# EAGLE schematic dbg-ram-4x8K (EAGLE 9.1.3)
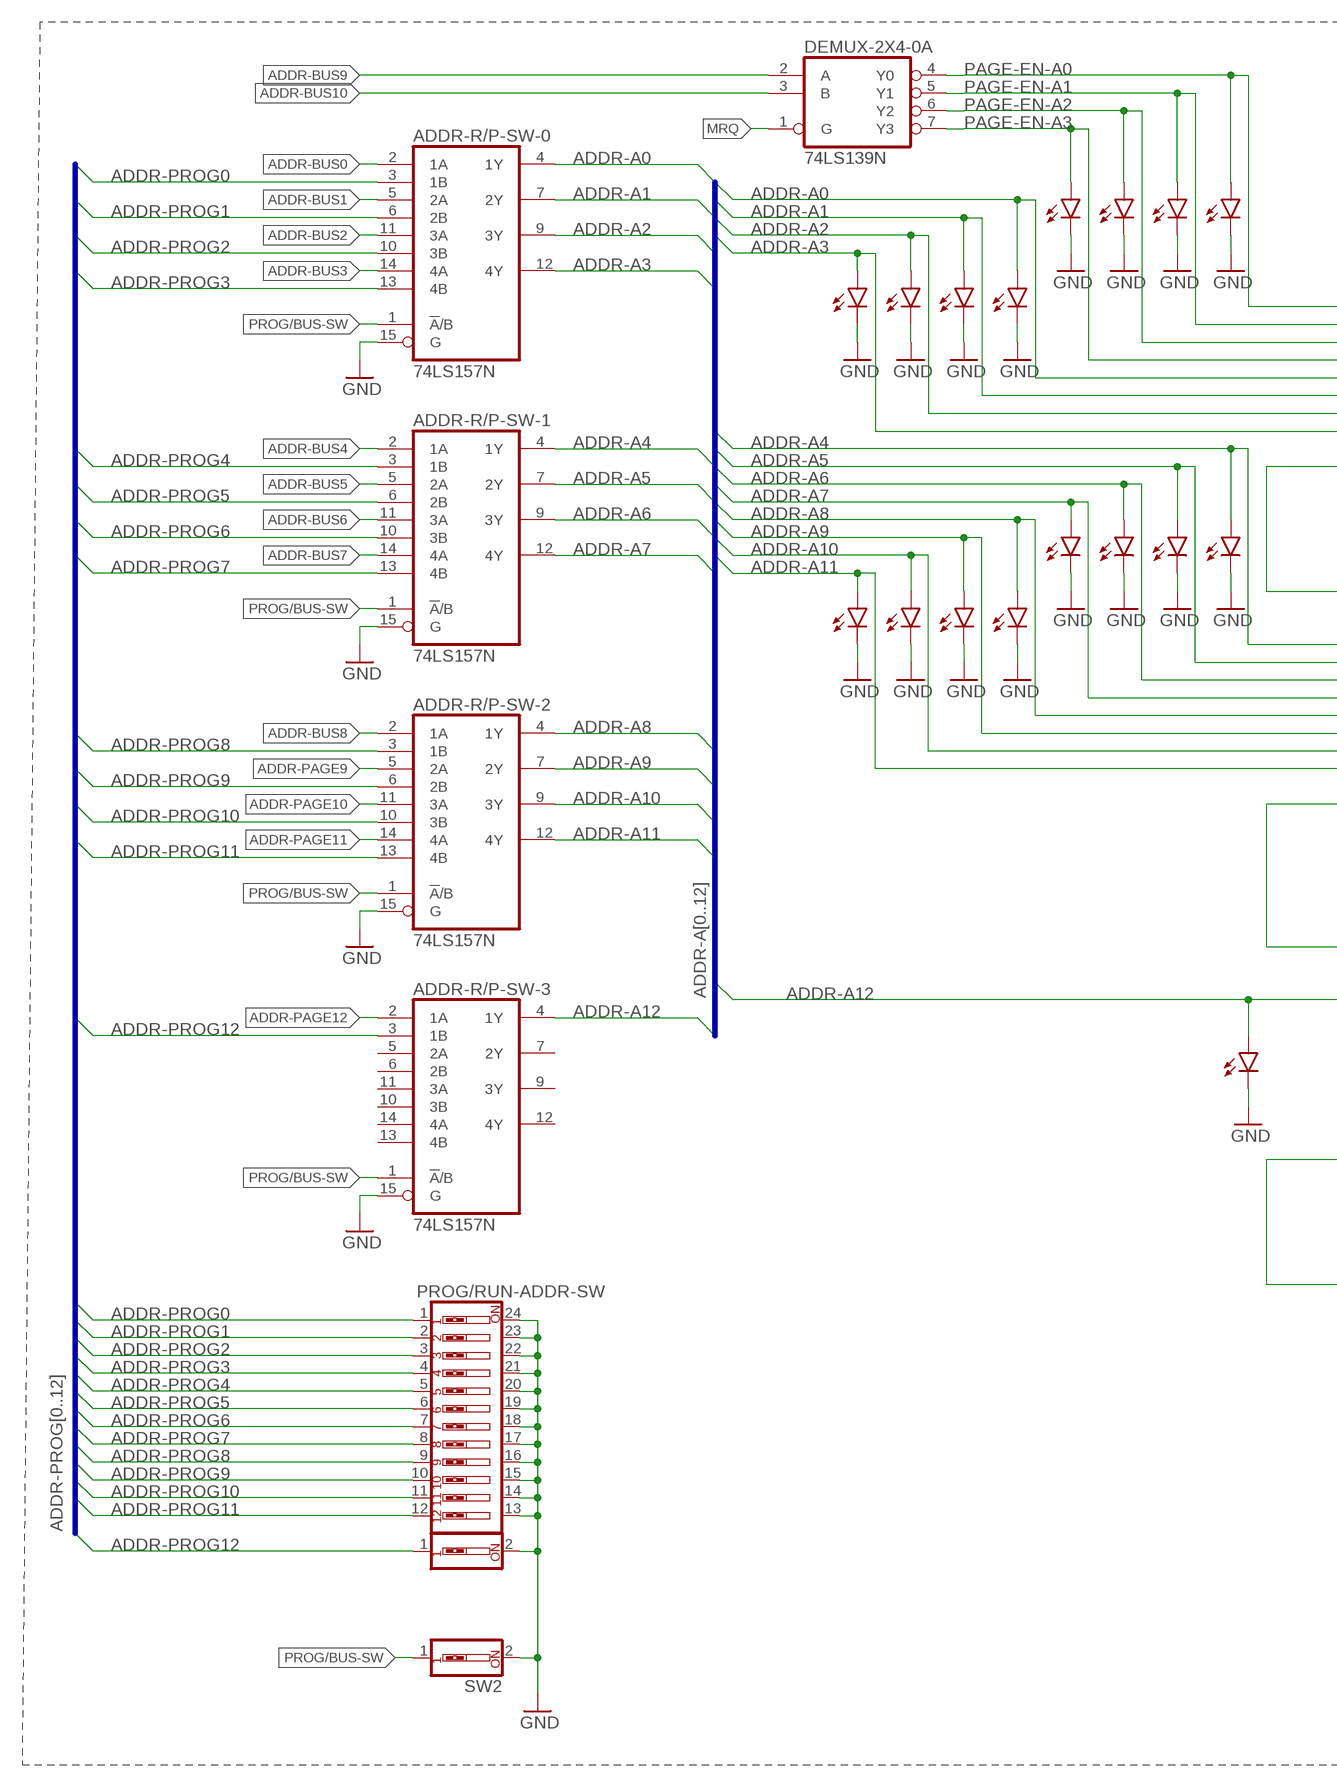
[diagram p0: schematic, sheet 1, part 1 of 2]
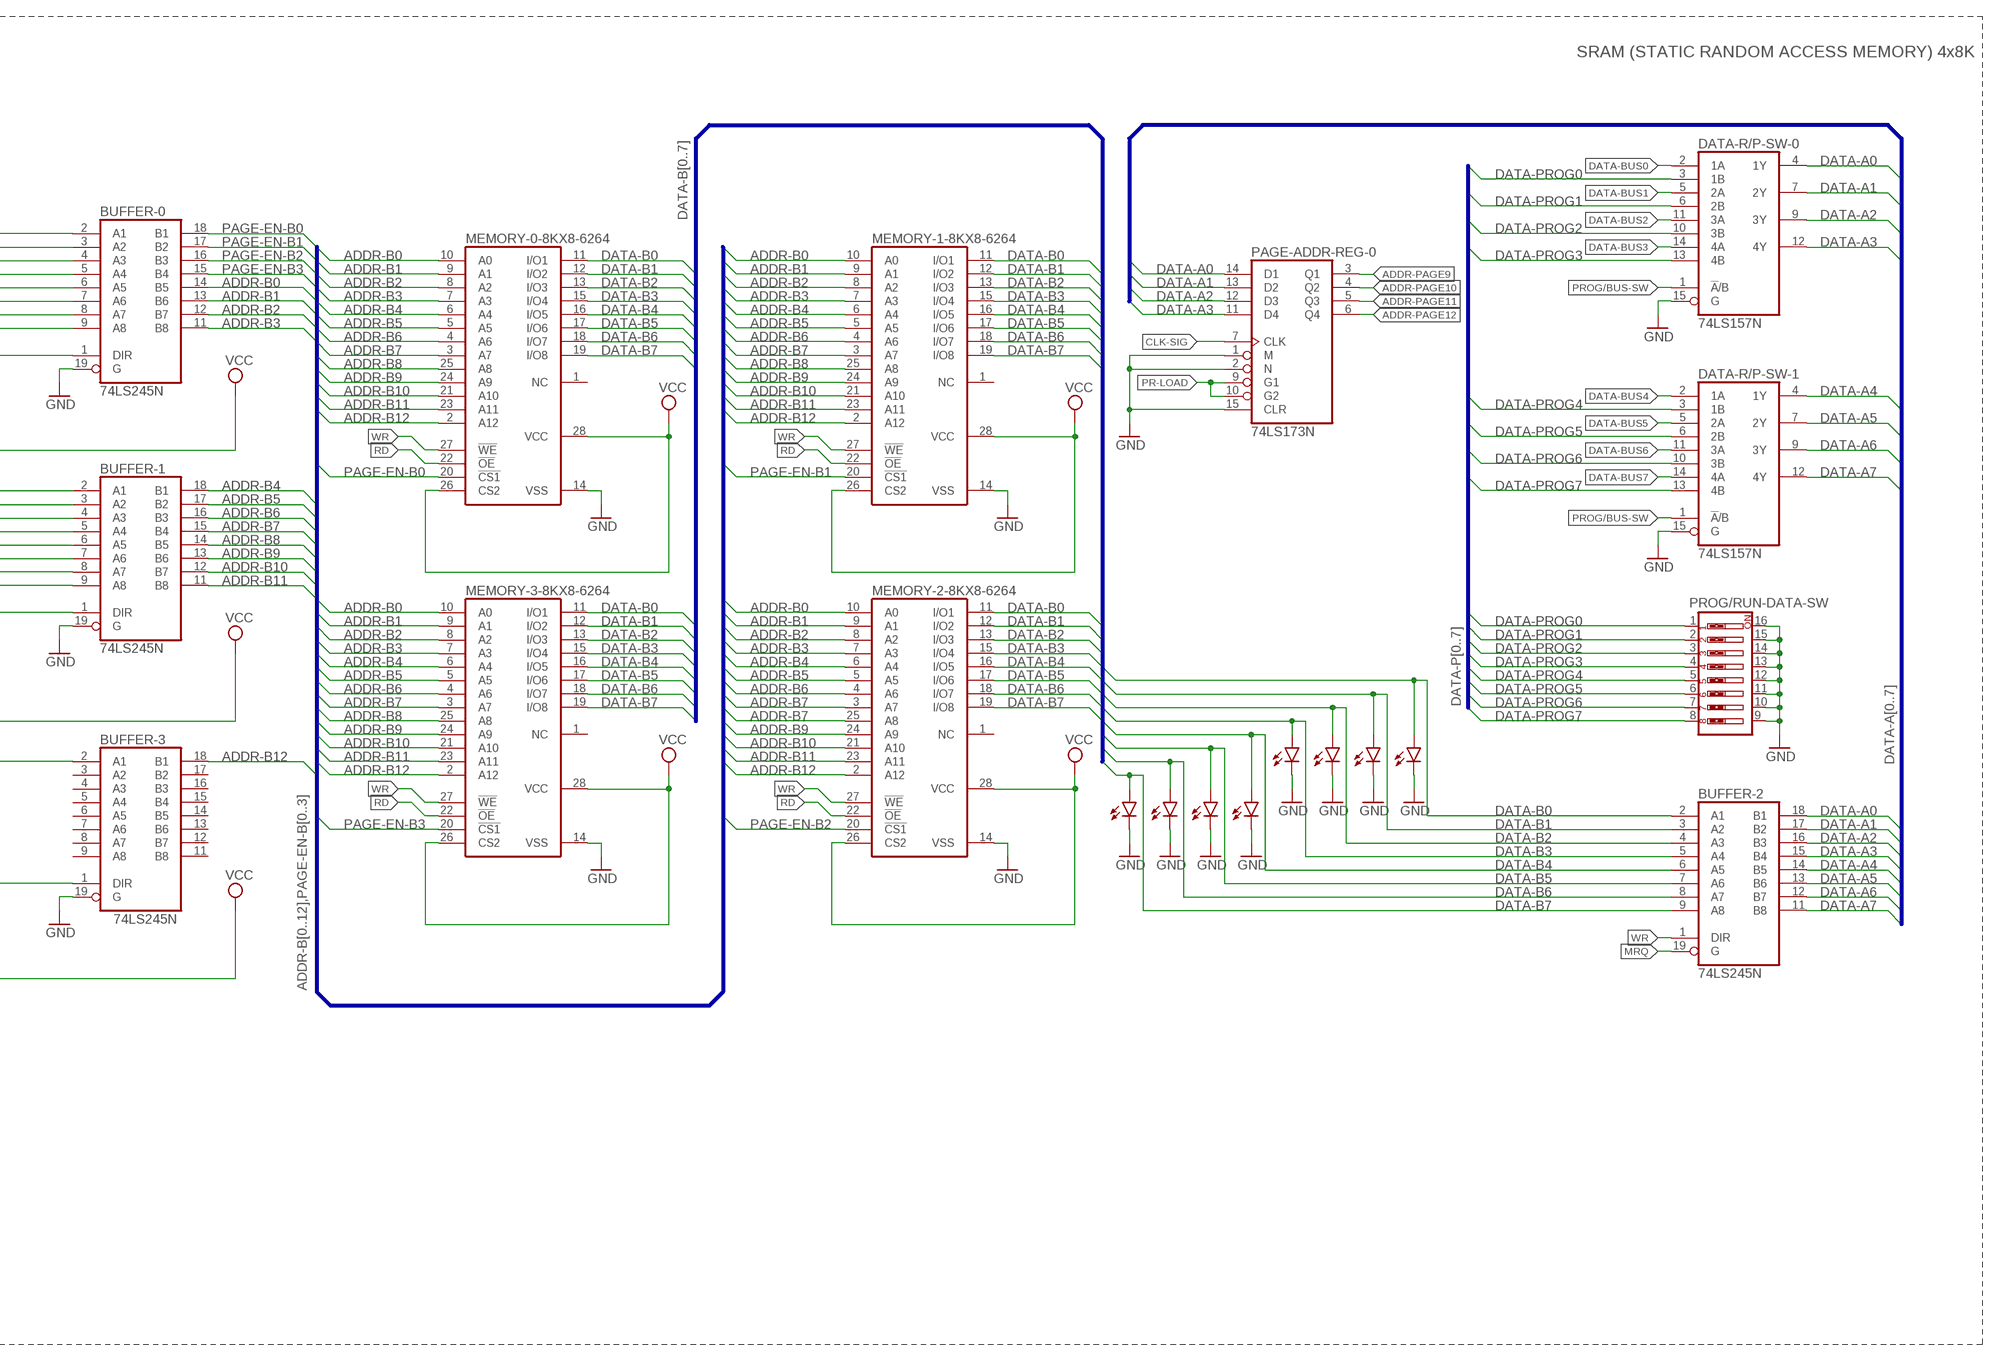
[diagram p1: schematic, sheet 1, part 2 of 2]

## Parts
ADDR-R/P-SW-0  74LS157N  [DIL16]
ADDR-R/P-SW-1  74LS157N  [DIL16]
ADDR-R/P-SW-2  74LS157N  [DIL16]
ADDR-R/P-SW-3  74LS157N  [DIL16]
BUFFER-0  74LS245N  [DIL20]
BUFFER-1  74LS245N  [DIL20]
BUFFER-2  74LS245N  [DIL20]
BUFFER-3  74LS245N  [DIL20]
DATA-R/P-SW-0  74LS157N  [DIL16]
DATA-R/P-SW-1  74LS157N  [DIL16]
DEMUX-2X4-0  74LS139N  [DIL16]
LED1  LED5MM  [LED5MM]
LED2  LED5MM  [LED5MM]
LED3  LED5MM  [LED5MM]
LED4  LED5MM  [LED5MM]
LED5  LED5MM  [LED5MM]
LED6  LED5MM  [LED5MM]
LED7  LED5MM  [LED5MM]
LED8  LED5MM  [LED5MM]
LED9  LED5MM  [LED5MM]
LED10  LED5MM  [LED5MM]
LED11  LED5MM  [LED5MM]
LED12  LED5MM  [LED5MM]
LED13  LED5MM  [LED5MM]
LED14  LED5MM  [LED5MM]
LED15  LED5MM  [LED5MM]
LED16  LED5MM  [LED5MM]
LED17  LED5MM  [LED5MM]
LED18  LED5MM  [LED5MM]
LED19  LED5MM  [LED5MM]
LED20  LED5MM  [LED5MM]
LED21  LED5MM  [LED5MM]
LED22  LED5MM  [LED5MM]
LED23  LED5MM  [LED5MM]
LED24  LED5MM  [LED5MM]
LED25  LED5MM  [LED5MM]
MEMORY-0-8KX8-6264  6264A  [DIL28-6]
MEMORY-1-8KX8-6264  6264A  [DIL28-6]
MEMORY-2-8KX8-6264  6264A  [DIL28-6]
MEMORY-3-8KX8-6264  6264A  [DIL28-6]
PAGE-ADDR-REG-0  74LS173N  [DIL16]
PROG/RUN-ADDR-SW  SW_DIP-12  [EDG-12]
PROG/RUN-DATA-SW  SW_DIP-8  [EDG-08]
SW2  SW_DIP-1  [EDG-01]
SW3  SW_DIP-1  [EDG-01]

## Nets
ADDR-A0: ADDR-R/P-SW-0.4(1Y) BUFFER-0.6(A5) LED1.A
ADDR-A1: ADDR-R/P-SW-0.7(2Y) BUFFER-0.7(A6) LED2.A
ADDR-A2: ADDR-R/P-SW-0.9(3Y) BUFFER-0.8(A7) LED3.A
ADDR-A3: ADDR-R/P-SW-0.12(4Y) BUFFER-0.9(A8) LED4.A
ADDR-A4: ADDR-R/P-SW-1.4(1Y) BUFFER-1.2(A1) LED5.A
ADDR-A5: ADDR-R/P-SW-1.7(2Y) BUFFER-1.3(A2) LED6.A
ADDR-A6: ADDR-R/P-SW-1.9(3Y) BUFFER-1.4(A3) LED10.A
ADDR-A7: ADDR-R/P-SW-1.12(4Y) BUFFER-1.5(A4) LED7.A
ADDR-A8: ADDR-R/P-SW-2.4(1Y) BUFFER-1.6(A5) LED8.A
ADDR-A9: ADDR-R/P-SW-2.7(2Y) BUFFER-1.7(A6) LED9.A
ADDR-A10: ADDR-R/P-SW-2.9(3Y) BUFFER-1.8(A7) LED15.A
ADDR-A11: ADDR-R/P-SW-2.12(4Y) BUFFER-1.9(A8) LED17.A
ADDR-A12: ADDR-R/P-SW-3.4(1Y) BUFFER-3.2(A1) LED16.A
ADDR-B0: BUFFER-0.14(B5) MEMORY-0-8KX8-6264.10(A0) MEMORY-1-8KX8-6264.10(A0) MEMORY-2-8KX8-6264.10(A0) MEMORY-3-8KX8-6264.10(A0)
ADDR-B1: BUFFER-0.13(B6) MEMORY-0-8KX8-6264.9(A1) MEMORY-1-8KX8-6264.9(A1) MEMORY-2-8KX8-6264.9(A1) MEMORY-3-8KX8-6264.9(A1)
ADDR-B2: BUFFER-0.12(B7) MEMORY-0-8KX8-6264.8(A2) MEMORY-1-8KX8-6264.8(A2) MEMORY-2-8KX8-6264.8(A2) MEMORY-3-8KX8-6264.8(A2)
ADDR-B3: BUFFER-0.11(B8) MEMORY-0-8KX8-6264.7(A3) MEMORY-1-8KX8-6264.7(A3) MEMORY-2-8KX8-6264.7(A3) MEMORY-3-8KX8-6264.7(A3)
ADDR-B4: BUFFER-1.18(B1) MEMORY-0-8KX8-6264.6(A4) MEMORY-1-8KX8-6264.6(A4) MEMORY-2-8KX8-6264.6(A4) MEMORY-3-8KX8-6264.6(A4)
ADDR-B5: BUFFER-1.17(B2) MEMORY-0-8KX8-6264.5(A5) MEMORY-1-8KX8-6264.5(A5) MEMORY-2-8KX8-6264.5(A5) MEMORY-3-8KX8-6264.5(A5)
ADDR-B6: BUFFER-1.16(B3) MEMORY-0-8KX8-6264.4(A6) MEMORY-1-8KX8-6264.4(A6) MEMORY-2-8KX8-6264.4(A6) MEMORY-3-8KX8-6264.4(A6)
ADDR-B7: BUFFER-1.15(B4) MEMORY-0-8KX8-6264.3(A7) MEMORY-1-8KX8-6264.3(A7) MEMORY-2-8KX8-6264.3(A7) MEMORY-2-8KX8-6264.25(A8) MEMORY-3-8KX8-6264.3(A7)
ADDR-B8: BUFFER-1.14(B5) MEMORY-0-8KX8-6264.25(A8) MEMORY-1-8KX8-6264.25(A8) MEMORY-3-8KX8-6264.25(A8)
ADDR-B9: BUFFER-1.13(B6) MEMORY-0-8KX8-6264.24(A9) MEMORY-1-8KX8-6264.24(A9) MEMORY-2-8KX8-6264.24(A9) MEMORY-3-8KX8-6264.24(A9)
ADDR-B10: BUFFER-1.12(B7) MEMORY-0-8KX8-6264.21(A10) MEMORY-1-8KX8-6264.21(A10) MEMORY-2-8KX8-6264.21(A10) MEMORY-3-8KX8-6264.21(A10)
ADDR-B11: BUFFER-1.11(B8) MEMORY-0-8KX8-6264.23(A11) MEMORY-1-8KX8-6264.23(A11) MEMORY-2-8KX8-6264.23(A11) MEMORY-3-8KX8-6264.23(A11)
ADDR-B12: BUFFER-3.18(B1) MEMORY-0-8KX8-6264.2(A12) MEMORY-1-8KX8-6264.2(A12) MEMORY-2-8KX8-6264.2(A12) MEMORY-3-8KX8-6264.2(A12)
ADDR-BUS0: ADDR-R/P-SW-0.2(1A)
ADDR-BUS1: ADDR-R/P-SW-0.5(2A)
ADDR-BUS2: ADDR-R/P-SW-0.11(3A)
ADDR-BUS3: ADDR-R/P-SW-0.14(4A)
ADDR-BUS4: ADDR-R/P-SW-1.2(1A)
ADDR-BUS5: ADDR-R/P-SW-1.5(2A)
ADDR-BUS6: ADDR-R/P-SW-1.11(3A)
ADDR-BUS7: ADDR-R/P-SW-1.14(4A)
ADDR-BUS8: ADDR-R/P-SW-2.2(1A)
ADDR-BUS9: DEMUX-2X4-0.2(A:A)
ADDR-BUS10: DEMUX-2X4-0.3(A:B)
ADDR-PAGE9: ADDR-R/P-SW-2.5(2A) PAGE-ADDR-REG-0.3(Q1)
ADDR-PAGE10: ADDR-R/P-SW-2.11(3A) PAGE-ADDR-REG-0.4(Q2)
ADDR-PAGE11: ADDR-R/P-SW-2.14(4A) PAGE-ADDR-REG-0.5(Q3)
ADDR-PAGE12: ADDR-R/P-SW-3.2(1A) PAGE-ADDR-REG-0.6(Q4)
ADDR-PROG0: ADDR-R/P-SW-0.3(1B) PROG/RUN-ADDR-SW.1
ADDR-PROG1: ADDR-R/P-SW-0.6(2B) PROG/RUN-ADDR-SW.2
ADDR-PROG2: ADDR-R/P-SW-0.10(3B) PROG/RUN-ADDR-SW.3
ADDR-PROG3: ADDR-R/P-SW-0.13(4B) PROG/RUN-ADDR-SW.4
ADDR-PROG4: ADDR-R/P-SW-1.3(1B) PROG/RUN-ADDR-SW.5
ADDR-PROG5: ADDR-R/P-SW-1.6(2B) PROG/RUN-ADDR-SW.6
ADDR-PROG6: ADDR-R/P-SW-1.10(3B) PROG/RUN-ADDR-SW.7
ADDR-PROG7: ADDR-R/P-SW-1.13(4B) PROG/RUN-ADDR-SW.8
ADDR-PROG8: ADDR-R/P-SW-2.3(1B) PROG/RUN-ADDR-SW.9
ADDR-PROG9: ADDR-R/P-SW-2.6(2B) PROG/RUN-ADDR-SW.10
ADDR-PROG10: ADDR-R/P-SW-2.10(3B) PROG/RUN-ADDR-SW.11
ADDR-PROG11: ADDR-R/P-SW-2.13(4B) PROG/RUN-ADDR-SW.12
ADDR-PROG12: ADDR-R/P-SW-3.3(1B) SW3.1
CLK-SIG: PAGE-ADDR-REG-0.7(CLK)
DATA-A0: BUFFER-2.18(B1) DATA-R/P-SW-0.4(1Y) PAGE-ADDR-REG-0.14(D1)
DATA-A1: BUFFER-2.17(B2) DATA-R/P-SW-0.7(2Y) PAGE-ADDR-REG-0.13(D2)
DATA-A2: BUFFER-2.16(B3) DATA-R/P-SW-0.9(3Y) PAGE-ADDR-REG-0.12(D3)
DATA-A3: BUFFER-2.15(B4) DATA-R/P-SW-0.12(4Y) PAGE-ADDR-REG-0.11(D4)
DATA-A4: BUFFER-2.14(B5) DATA-R/P-SW-1.4(1Y)
DATA-A5: BUFFER-2.13(B6) DATA-R/P-SW-1.7(2Y)
DATA-A6: BUFFER-2.12(B7) DATA-R/P-SW-1.9(3Y)
DATA-A7: BUFFER-2.11(B8) DATA-R/P-SW-1.12(4Y)
DATA-B0: BUFFER-2.2(A1) LED25.A MEMORY-0-8KX8-6264.11(I/O1) MEMORY-1-8KX8-6264.11(I/O1) MEMORY-2-8KX8-6264.11(I/O1) MEMORY-3-8KX8-6264.11(I/O1)
DATA-B1: BUFFER-2.3(A2) LED24.A MEMORY-0-8KX8-6264.12(I/O2) MEMORY-1-8KX8-6264.12(I/O2) MEMORY-2-8KX8-6264.12(I/O2) MEMORY-3-8KX8-6264.12(I/O2)
DATA-B2: BUFFER-2.4(A3) LED23.A MEMORY-0-8KX8-6264.13(I/O3) MEMORY-1-8KX8-6264.13(I/O3) MEMORY-2-8KX8-6264.13(I/O3) MEMORY-3-8KX8-6264.13(I/O3)
DATA-B3: BUFFER-2.5(A4) LED22.A MEMORY-0-8KX8-6264.15(I/O4) MEMORY-1-8KX8-6264.15(I/O4) MEMORY-2-8KX8-6264.15(I/O4) MEMORY-3-8KX8-6264.15(I/O4)
DATA-B4: BUFFER-2.6(A5) LED21.A MEMORY-0-8KX8-6264.16(I/O5) MEMORY-1-8KX8-6264.16(I/O5) MEMORY-2-8KX8-6264.16(I/O5) MEMORY-3-8KX8-6264.16(I/O5)
DATA-B5: BUFFER-2.7(A6) LED20.A MEMORY-0-8KX8-6264.17(I/O6) MEMORY-1-8KX8-6264.17(I/O6) MEMORY-2-8KX8-6264.17(I/O6) MEMORY-3-8KX8-6264.17(I/O6)
DATA-B6: BUFFER-2.8(A7) LED19.A MEMORY-0-8KX8-6264.18(I/O7) MEMORY-1-8KX8-6264.18(I/O7) MEMORY-2-8KX8-6264.18(I/O7) MEMORY-3-8KX8-6264.18(I/O7)
DATA-B7: BUFFER-2.9(A8) LED18.A MEMORY-0-8KX8-6264.19(I/O8) MEMORY-1-8KX8-6264.19(I/O8) MEMORY-2-8KX8-6264.19(I/O8) MEMORY-3-8KX8-6264.19(I/O8)
DATA-BUS0: DATA-R/P-SW-0.2(1A)
DATA-BUS1: DATA-R/P-SW-0.5(2A)
DATA-BUS2: DATA-R/P-SW-0.11(3A)
DATA-BUS3: DATA-R/P-SW-0.14(4A)
DATA-BUS4: DATA-R/P-SW-1.2(1A)
DATA-BUS5: DATA-R/P-SW-1.5(2A)
DATA-BUS6: DATA-R/P-SW-1.11(3A)
DATA-BUS7: DATA-R/P-SW-1.14(4A)
DATA-PROG0: DATA-R/P-SW-0.3(1B) PROG/RUN-DATA-SW.1
DATA-PROG1: DATA-R/P-SW-0.6(2B) PROG/RUN-DATA-SW.2
DATA-PROG2: DATA-R/P-SW-0.10(3B) PROG/RUN-DATA-SW.3
DATA-PROG3: DATA-R/P-SW-0.13(4B) PROG/RUN-DATA-SW.4
DATA-PROG4: DATA-R/P-SW-1.3(1B) PROG/RUN-DATA-SW.5
DATA-PROG5: DATA-R/P-SW-1.6(2B) PROG/RUN-DATA-SW.6
DATA-PROG6: DATA-R/P-SW-1.10(3B) PROG/RUN-DATA-SW.7
DATA-PROG7: DATA-R/P-SW-1.13(4B) PROG/RUN-DATA-SW.8
GND: ADDR-R/P-SW-0.15(G) ADDR-R/P-SW-1.15(G) ADDR-R/P-SW-2.15(G) ADDR-R/P-SW-3.15(G) BUFFER-0.19(G) BUFFER-1.19(G) BUFFER-3.19(G) DATA-R/P-SW-0.15(G) DATA-R/P-SW-1.15(G) LED1.K(C) LED2.K(C) LED3.K(C) LED4.K(C) LED5.K(C) LED6.K(C) LED7.K(C) LED8.K(C) LED9.K(C) LED10.K(C) LED11.K(C) LED12.K(C) LED13.K(C) LED14.K(C) LED15.K(C) LED16.K(C) LED17.K(C) LED18.K(C) LED19.K(C) LED20.K(C) LED21.K(C) LED22.K(C) LED23.K(C) LED24.K(C) LED25.K(C) MEMORY-0-8KX8-6264.14(VSS) MEMORY-1-8KX8-6264.14(VSS) MEMORY-2-8KX8-6264.14(VSS) MEMORY-3-8KX8-6264.14(VSS) PAGE-ADDR-REG-0.1(M) PAGE-ADDR-REG-0.2(N) PAGE-ADDR-REG-0.15(CLR) PROG/RUN-ADDR-SW.13 PROG/RUN-ADDR-SW.14 PROG/RUN-ADDR-SW.15 PROG/RUN-ADDR-SW.16 PROG/RUN-ADDR-SW.17 PROG/RUN-ADDR-SW.18 PROG/RUN-ADDR-SW.19 PROG/RUN-ADDR-SW.20 PROG/RUN-ADDR-SW.21 PROG/RUN-ADDR-SW.22 PROG/RUN-ADDR-SW.23 PROG/RUN-ADDR-SW.24 PROG/RUN-DATA-SW.9 PROG/RUN-DATA-SW.10 PROG/RUN-DATA-SW.11 PROG/RUN-DATA-SW.12 PROG/RUN-DATA-SW.13 PROG/RUN-DATA-SW.14 PROG/RUN-DATA-SW.15 PROG/RUN-DATA-SW.16 SW2.2 SW3.2
MRQ: BUFFER-2.19(G) DEMUX-2X4-0.1(A:G)
PAGE-EN-A0: BUFFER-0.2(A1) DEMUX-2X4-0.4(A:Y0) LED11.A
PAGE-EN-A1: BUFFER-0.3(A2) DEMUX-2X4-0.5(A:Y1) LED12.A
PAGE-EN-A2: BUFFER-0.4(A3) DEMUX-2X4-0.6(A:Y2) LED13.A
PAGE-EN-A3: BUFFER-0.5(A4) DEMUX-2X4-0.7(A:Y3) LED14.A
PAGE-EN-B0: BUFFER-0.18(B1) MEMORY-0-8KX8-6264.20(!CS1)
PAGE-EN-B1: BUFFER-0.17(B2) MEMORY-1-8KX8-6264.20(!CS1)
PAGE-EN-B2: BUFFER-0.16(B3) MEMORY-2-8KX8-6264.20(!CS1)
PAGE-EN-B3: BUFFER-0.15(B4) MEMORY-3-8KX8-6264.20(!CS1)
PR-LOAD: PAGE-ADDR-REG-0.9(G1) PAGE-ADDR-REG-0.10(G2)
PROG/BUS-SW: ADDR-R/P-SW-0.1(!A!/B) ADDR-R/P-SW-1.1(!A!/B) ADDR-R/P-SW-2.1(!A!/B) ADDR-R/P-SW-3.1(!A!/B) DATA-R/P-SW-0.1(!A!/B) DATA-R/P-SW-1.1(!A!/B) SW2.1
RD: MEMORY-0-8KX8-6264.22(!OE) MEMORY-1-8KX8-6264.22(!OE) MEMORY-2-8KX8-6264.22(!OE) MEMORY-3-8KX8-6264.22(!OE)
VCC: BUFFER-0.1(DIR) BUFFER-1.1(DIR) BUFFER-3.1(DIR) MEMORY-0-8KX8-6264.26(CS2) MEMORY-0-8KX8-6264.28(VCC) MEMORY-1-8KX8-6264.26(CS2) MEMORY-1-8KX8-6264.28(VCC) MEMORY-2-8KX8-6264.26(CS2) MEMORY-2-8KX8-6264.28(VCC) MEMORY-3-8KX8-6264.26(CS2) MEMORY-3-8KX8-6264.28(VCC)
WR: BUFFER-2.1(DIR) MEMORY-0-8KX8-6264.27(!WE) MEMORY-1-8KX8-6264.27(!WE) MEMORY-2-8KX8-6264.27(!WE) MEMORY-3-8KX8-6264.27(!WE)
Unconnected: ADDR-R/P-SW-3.5(2A) ADDR-R/P-SW-3.6(2B) ADDR-R/P-SW-3.7(2Y) ADDR-R/P-SW-3.9(3Y) ADDR-R/P-SW-3.10(3B) ADDR-R/P-SW-3.11(3A) ADDR-R/P-SW-3.12(4Y) ADDR-R/P-SW-3.13(4B) ADDR-R/P-SW-3.14(4A) BUFFER-3.3(A2) BUFFER-3.4(A3) BUFFER-3.5(A4) BUFFER-3.6(A5) BUFFER-3.7(A6) BUFFER-3.8(A7) BUFFER-3.9(A8) BUFFER-3.11(B8) BUFFER-3.12(B7) BUFFER-3.13(B6) BUFFER-3.14(B5) BUFFER-3.15(B4) BUFFER-3.16(B3) BUFFER-3.17(B2) DEMUX-2X4-0.9(B:Y3) DEMUX-2X4-0.10(B:Y2) DEMUX-2X4-0.11(B:Y1) DEMUX-2X4-0.12(B:Y0) DEMUX-2X4-0.13(B:B) DEMUX-2X4-0.14(B:A) DEMUX-2X4-0.15(B:G) MEMORY-0-8KX8-6264.1(NC) MEMORY-1-8KX8-6264.1(NC) MEMORY-2-8KX8-6264.1(NC) MEMORY-3-8KX8-6264.1(NC)

## Buses
ADDR-B[0..12],PAGE-EN-B[0..3]
DATA-B[0..7]
ADDR-A[0..12]
ADDR-PROG[0..12]
DATA-A[0..7]
DATA-P[0..7]

## Notes on the sheet
- SRAM (STATIC RANDOM ACCESS MEMORY) 4x8K

## Power pins joined to a net without a drawn wire
GND: ADDR-R/P-SW-0.8(GND) ADDR-R/P-SW-1.8(GND) ADDR-R/P-SW-2.8(GND) ADDR-R/P-SW-3.8(GND) BUFFER-0.10(GND) BUFFER-1.10(GND) BUFFER-2.10(GND) BUFFER-3.10(GND) DATA-R/P-SW-0.8(GND) DATA-R/P-SW-1.8(GND) DEMUX-2X4-0.8(P:GND) PAGE-ADDR-REG-0.8(GND)
VCC: ADDR-R/P-SW-0.16(VCC) ADDR-R/P-SW-1.16(VCC) ADDR-R/P-SW-2.16(VCC) ADDR-R/P-SW-3.16(VCC) BUFFER-0.20(VCC) BUFFER-1.20(VCC) BUFFER-2.20(VCC) BUFFER-3.20(VCC) DATA-R/P-SW-0.16(VCC) DATA-R/P-SW-1.16(VCC) DEMUX-2X4-0.16(P:VCC) PAGE-ADDR-REG-0.16(VCC)

## Library data of the parts
ADDR-R/P-SW-0 ADDR-R/P-SW-1-ADDR-R/P-SW-3 DATA-R/P-SW-0 DATA-R/P-SW-1 = 74xx-eu:74*157: Quadruple 2-line to 1-line data SELECTOR/MULTIPLEXER
BUFFER-0 BUFFER-1-BUFFER-3 = 74xx-eu:74*245: Octal BUS TRANSCEIVER, 3-state
DEMUX-2X4-0 = 74xx-eu:74*139: Dual 2-line to 4-line DECODER/DEMULTIPLEXER
LED1-LED25 = led:LED: LED OSRAM: - CHIPLED LG R971, LG N971, LY N971, LG Q971, LY Q971, LO R971, LY R971 LH N974, LH R974 LS Q976, LO Q976, LY Q976 LO Q996 - Hyper CHIPLED LW Q18S LB Q993, LB Q99A, LB R99A - SideLED LS A670, LO A670, LY A670, LG A670, LP A670 LB A673, LV A673, LT A673, LW A673 LH A674 LY A675 LS A676, LA A676, LO A676, LY A676, LW A676 LS A679, LY A679, LG A679 - Hyper Micro SIDELED® LS Y876, LA Y876, LO Y876, LY Y876 LT Y87S - SmartLED LW L88C, LW L88S LB L89C, LB L89S, LG L890 LS L89K, LO L89K, LY L89K LS L896, LA L896, LO L896, LY L896 - TOPLED LS T670, LO T670, LY T670, LG T670, LP T670 LSG T670, LSP T670, LSY T670, LOP T670, LYG T670 LG T671, LOG T671, LSG T671 LB T673, LV T673, LT T673, LW T673 LH T674 LS T676, LA T676, LO T676, LY T676, LB T676, LH T676, LSB T676, LW T676 LB T67C, LV T67C, LT T67C, LS T67K, LO T67K, LY T67K, LW E67C LS E67B, LA E67B, LO E67B, LY E67B, LB E67C, LV E67C, LT E67C LW T67C LS T679, LY T679, LG T679 LS T770, LO T770, LY T770, LG T770, LP T770 LB T773, LV T773, LT T773, LW T773 LH T774 LS E675, LA E675, LY E675, LS T675 LS T776, LA T776, LO T776, LY T776, LB T776 LHGB T686 LT T68C, LB T68C - Hyper Mini TOPLED® LB M676 - Mini TOPLED Santana® LG M470 LS M47K, LO M47K, LY M47K Source: http://www.osram.convergy.de LUXEON: - LUMILED® LXK2-PW12-R00, LXK2-PW12-S00, LXK2-PW14-U00, LXK2-PW14-V00 LXK2-PM12-R00, LXK2-PM12-S00, LXK2-PM14-U00 LXK2-PE12-Q00, LXK2-PE12-R00, LXK2-PE12-S00, LXK2-PE14-T00, LXK2-PE14-U00 LXK2-PB12-K00, LXK2-PB12-L00, LXK2-PB12-M00, LXK2-PB14-N00, LXK2-PB14-P00, LXK2-PB14-Q00 LXK2-PR12-L00, LXK2-PR12-M00, LXK2-PR14-Q00, LXK2-PR14-R00 LXK2-PD12-Q00, LXK2-PD12-R00, LXK2-PD12-S00 LXK2-PH12-R00, LXK2-PH12-S00 LXK2-PL12-P00, LXK2-PL12-Q00, LXK2-PL12-R00 Source: www.luxeon.com KINGBRIGHT: KA-3528ASYC Source: www.kingbright.com
MEMORY-0-8KX8-6264 MEMORY-1-8KX8-6264 MEMORY-2-8KX8-6264 MEMORY-3-8KX8-6264 = memory-hitachi:6264A: MEMORY; OC_FARNELL: 283605; OC_NEWARK: unknown
PAGE-ADDR-REG-0 = 74xx-eu:74*173: 4-bit D type REGISTER, 3-state
PROG/RUN-ADDR-SW = special:SW_DIP-12: DIP SWITCH
PROG/RUN-DATA-SW = special:SW_DIP-8: DIP SWITCH
SW2 SW3 = special:SW_DIP-1: DIP SWITCH